# EAGLE design IV_Swinger_2_cell (EAGLE 9.2.2)
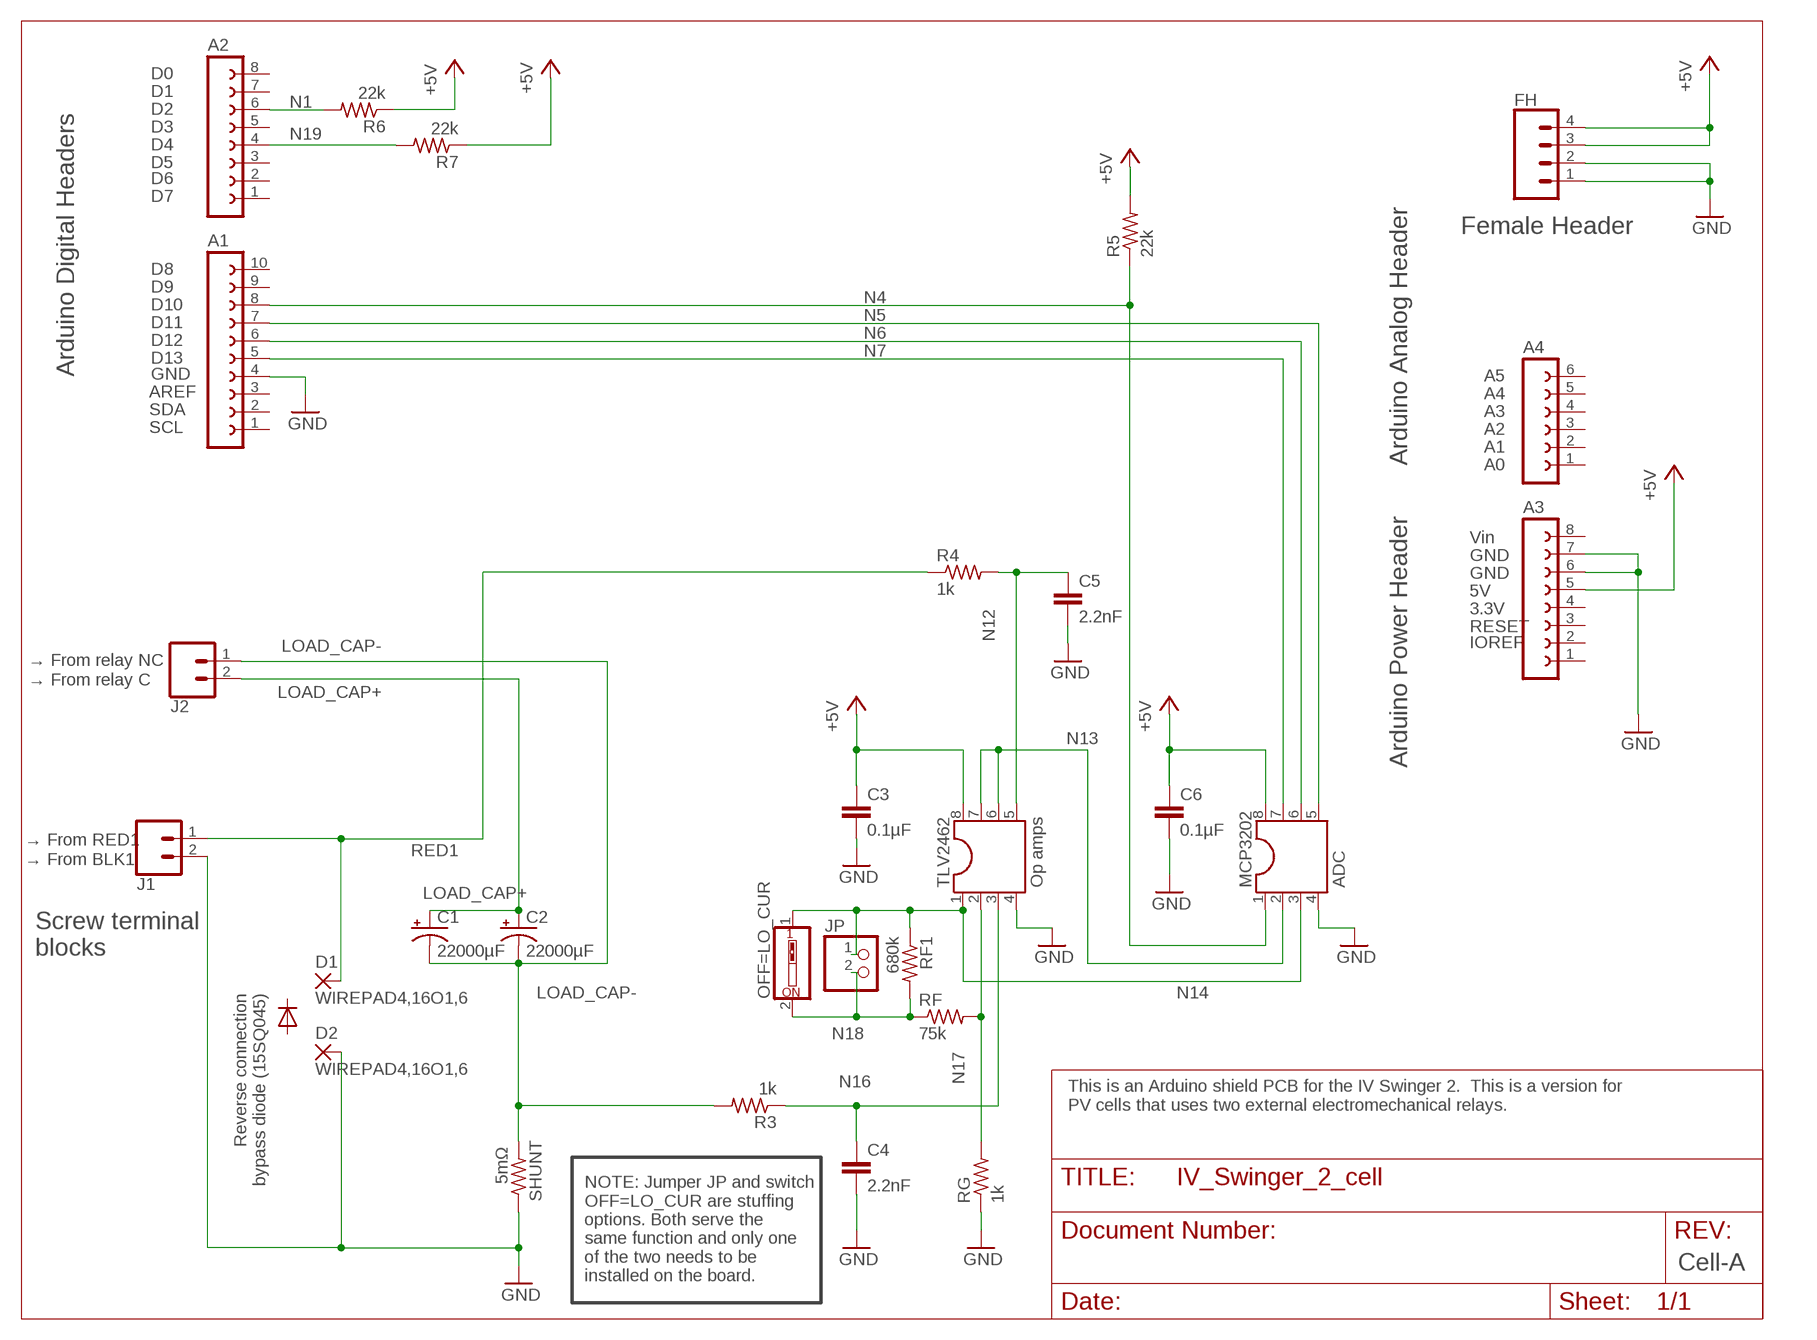
[diagram p0: schematic, sheet 1]

## Parts
A1  FE10-1  [FE10]
A2  FE08-1  [FE08]
A3  FE08-1  [FE08]
A4  FE06-1  [FE06]
C1  22000µF  CPOL-USE7.5-18  [E7,5-18]
C2  22000µF  CPOL-USE7.5-18  [E7,5-18]
C3  0.1µF  C-EU025-030X050  [C025-030X050]
C4  2.2nF  C-EU025-030X050  [C025-030X050]
C5  2.2nF  C-EU025-030X050  [C025-030X050]
C6  0.1µF  C-EU025-030X050  [C025-030X050]
D1  WIREPAD4,16O1,6  [4,16O1,6]
D2  WIREPAD4,16O1,6  [4,16O1,6]
FH  CONN_04LONGPADS  [1X04_LONGPADS]
J1  CONN_025MM  [SCREWTERMINAL-5MM-2]
J2  CONN_025MM  [SCREWTERMINAL-5MM-2]
JP  PINHD-1X2  [1X02]
MCP3202  ADC  DIL8S  [SOCKET-08]
OFF=LO_CUR  SW_DIP-1  [EDG-01]
R3  1k  R-US_0207/10  [0207/10]
R4  1k  R-US_0207/10  [0207/10]
R5  22k  R-US_0207/10  [0207/10]
R6  22k  R-US_0207/10  [0207/10]
R7  22k  R-US_0207/10  [0207/10]
RF  75k  R-US_0207/10  [0207/10]
RF1  680k  R-US_0207/10  [0207/10]
RG  1k  R-US_0207/10  [0207/10]
SHUNT  5mΩ  R-US_0617/17  [0617/17]
TLV2462  Op amps  DIL8S  [SOCKET-08]

## Nets
+5V: A3.5 C3.1 C6.1 FH.3 FH.4 MCP3202.8 R5.2 R6.1 R7.1 TLV2462.8
GND: A1.4 A3.6 A3.7 C3.2 C4.2 C5.2 C6.2 D2.1(P) FH.1 FH.2 J1.2 MCP3202.4 RG.1 SHUNT.1 TLV2462.4
LOAD_CAP+: C1.+ C2.+ J2.2
LOAD_CAP-: C1.- C2.- J2.1 R3.2 SHUNT.2
N1: A2.6 R6.2
N4: A1.8 MCP3202.1 R5.1
N5: A1.7 MCP3202.5
N6: A1.6 MCP3202.6
N7: A1.5 MCP3202.7
N12: C5.1 R4.2 TLV2462.5
N13: MCP3202.2 TLV2462.6 TLV2462.7
N14: JP.1 MCP3202.3 OFF=LO_CUR.1 RF1.1 TLV2462.1
N16: C4.1 R3.1 TLV2462.3
N17: RF.2 RG.2 TLV2462.2
N18: JP.2 OFF=LO_CUR.2 RF1.2 RF.1
N19: A2.4 R7.2
RED1: D1.1(P) J1.1 R4.1
Unconnected: A1.1 A1.2 A1.3 A1.9 A1.10 A2.1 A2.2 A2.3 A2.5 A2.7 A2.8 A3.1 A3.2 A3.3 A3.4 A3.8 A4.1 A4.2 A4.3 A4.4 A4.5 A4.6

## Notes on the sheet
- D0
- D1
- D2
- D3
- D4
- D5
- D6
- D7
- Female Header
- D8
- D9
- D10
- D11
- D12
- D13
- Arduino Digital Headers | GND
- A5
- AREF | A4
- SDA | A3
- SCL | A2
- A1
- Arduino Analog Header
- A0
- Vin
- GND
- GND
- 5V
- 3.3V
- RESET
- IOREF
- → From relay NC
- → From relay C
- Arduino Power Header
- → From RED1
- → From BLK1
- Screw terminal 
  blocks
- Reverse connection
  bypass diode (15SQ045)
- This is an Arduino shield PCB for the IV Swinger 2.  This is a version for 
  PV cells that uses two external electromechanical relays.
- Cell-A
- NOTE: Jumper JP and switch 
  OFF=LO_CUR are stuffing 
  options. Both serve the 
  same function and only one 
  of the two needs to be 
  installed on the board.

## Library data of the parts
A1 = con-lsta:FE10-1: FEMALE HEADER; OC_FARNELL: unknown; OC_NEWARK: unknown
A2 A3 = con-lsta:FE08-1: FEMALE HEADER; OC_FARNELL: unknown; OC_NEWARK: unknown
A4 = con-lsta:FE06-1: FEMALE HEADER; OC_FARNELL: unknown; OC_NEWARK: unknown
C1 C2 = rcl:CPOL-US: POLARIZED CAPACITOR, American symbol; SPICEPREFIX: C
C3-C6 = rcl:C-EU: CAPACITOR, European symbol; SPICEPREFIX: C
D1 = wirepad:WIREPAD: Wire PAD connect wire on PCB; SPICEPREFIX: X
D2 = wirepad:WIREPAD: Wire PAD connect wire on PCB
FH = my_connectors:CONN_04: Multi connection point. Often used as Generic Header-pin footprint for 0.1 inch spaced/style header connections On any of the 0.1 inch spaced packages, you can populate with these: Break Away Headers - Straight <https://www.sparkfun.com/products/116> (PRT-00116) Break Away Male Headers - Right Angle <https://www.sparkfun.com/products/553> (PRT-00553) Female Headers <https://www.sparkfun.com/products/115> (PRT-00115) Break Away Headers - Machine Pin <https://www.sparkfun.com/products/117> (PRT-00117) Break Away Female Headers - Swiss Machine Pin <https://www.sparkfun.com/products/743> (PRT-00743) For SCREWTERMINALS and SPRING TERMINALS visit here: Screw Terimnals on SparkFun.com <https://www.sparkfun.com/search/results?term=Screw+Terminals> (5mm/3.5mm/2.54mm spacing) This device is also useful as a general connection point to wire up your design to another part of your project. Our various solder wires solder well into these plated through hole pads. Hook-Up Wire - Assortment (Stranded, 22 AWG) <https://www.sparkfun.com/products/11375> (PRT-11375) Hook-Up Wire - Assortment (Solid Core, 22 AWG) <https://www.sparkfun.com/products/11367> (PRT-11367) View the entire wire category on our website here <https://www.sparkfun.com/categories/141> Special notes: Molex polarized connector foot print use with SKU : PRT-08231 with associated crimp pins and housings. 1MM SMD Version SKU: PRT-10208; PROD_ID: CONN-09696
J1 J2 = SparkFun-Connectors:CONN_02: Multi connection point. Often used as Generic Header-pin footprint for 0.1 inch spaced/style header connections On any of the 0.1 inch spaced packages, you can populate with these: Break Away Headers - Straight <https://www.sparkfun.com/products/116> (PRT-00116) Break Away Male Headers - Right Angle <https://www.sparkfun.com/products/553> (PRT-00553) Female Headers <https://www.sparkfun.com/products/115> (PRT-00115) Break Away Headers - Machine Pin <https://www.sparkfun.com/products/117> (PRT-00117) Break Away Female Headers - Swiss Machine Pin <https://www.sparkfun.com/products/743> (PRT-00743) For SCREWTERMINALS and SPRING TERMINALS visit here: Screw Terimnals on SparkFun.com <https://www.sparkfun.com/search/results?term=Screw+Terminals> (5mm/3.5mm/2.54mm spacing) This device is also useful as a general connection point to wire up your design to another part of your project. Our various solder wires solder well into these plated through hole pads. Hook-Up Wire - Assortment (Stranded, 22 AWG) <https://www.sparkfun.com/products/11375> (PRT-11375) Hook-Up Wire - Assortment (Solid Core, 22 AWG) <https://www.sparkfun.com/products/11367> (PRT-11367) View the entire wire category on our website here <https://www.sparkfun.com/categories/141> Special notes: Molex polarized connector foot print use with: PRT-08233 with associated crimp pins and housings. 2.54_SCREWTERM for use with PRT-10571. 3.5mm Screw Terminal footprints for PRT-08084 5mm Screw Terminal footprints for use with PRT-08432; SF_SKU: PRT-08432
JP = pinhead:PINHD-1X2: PIN HEADER
MCP3202 TLV2462 = ic-package:DIL8: Dual In Line / Socket
OFF=LO_CUR = special:SW_DIP-1: DIP SWITCH
R3-R7 RF RF1 RG SHUNT = rcl:R-US_: RESISTOR, American symbol; SPICEPREFIX: R

## Board
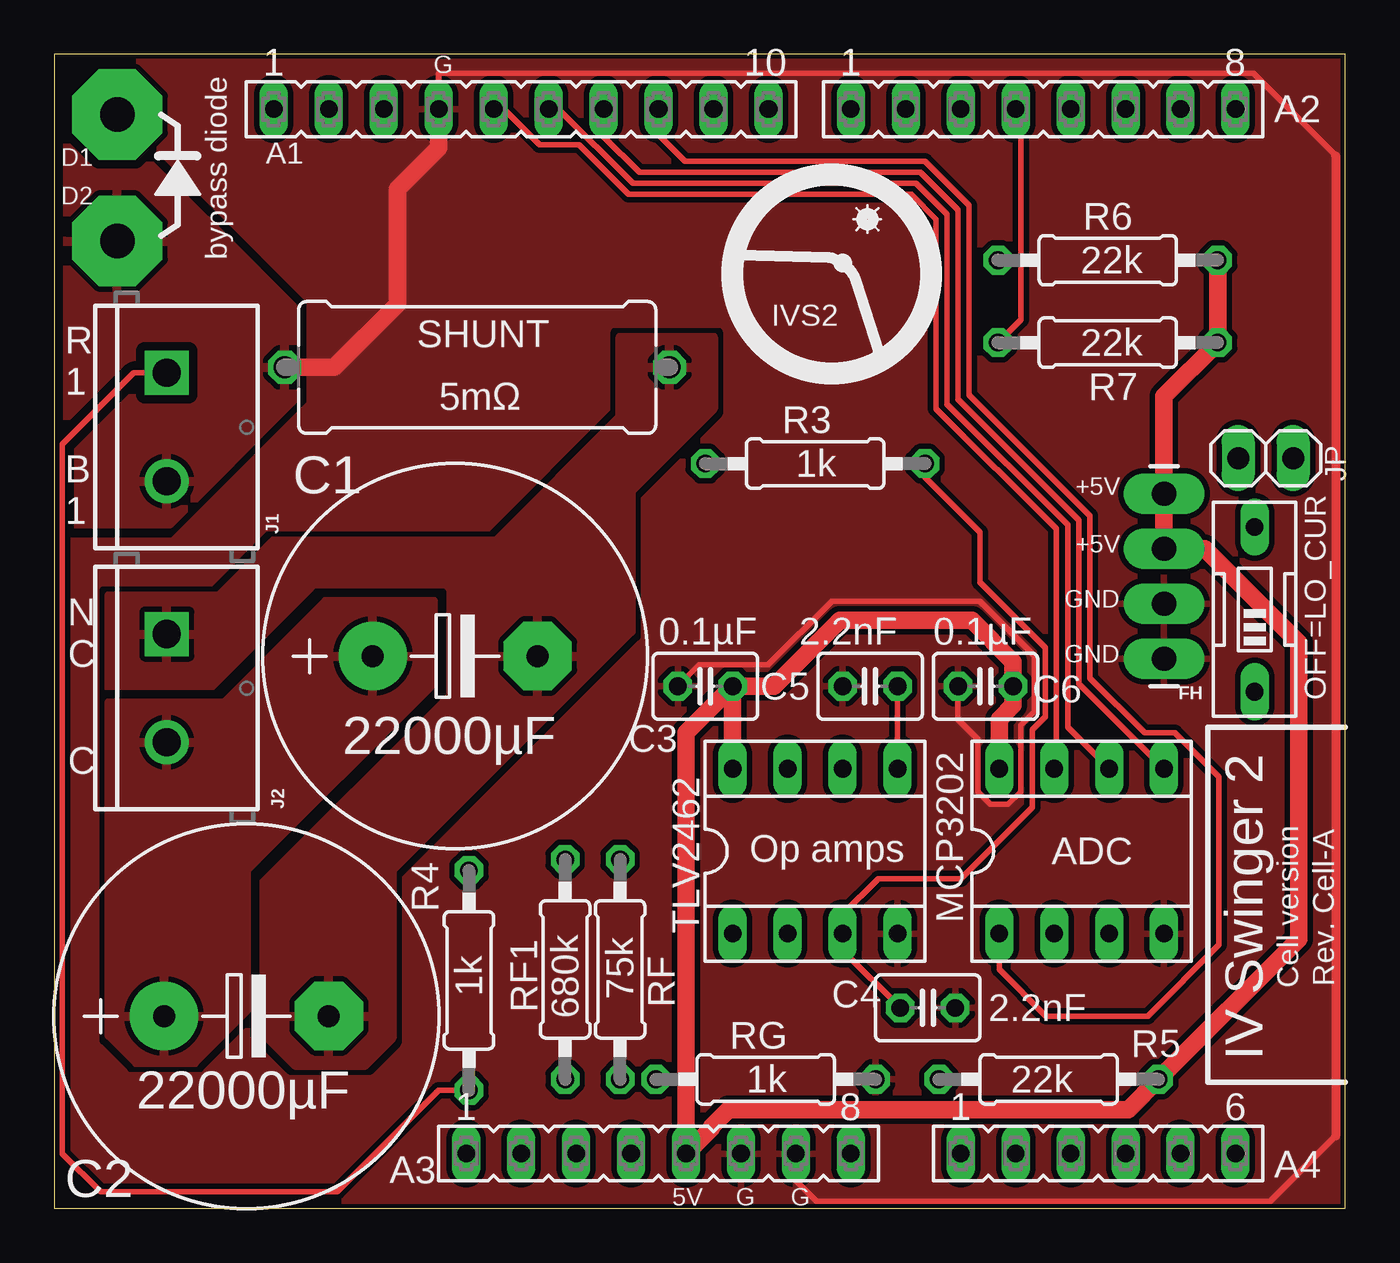
[diagram p1: board, top side]
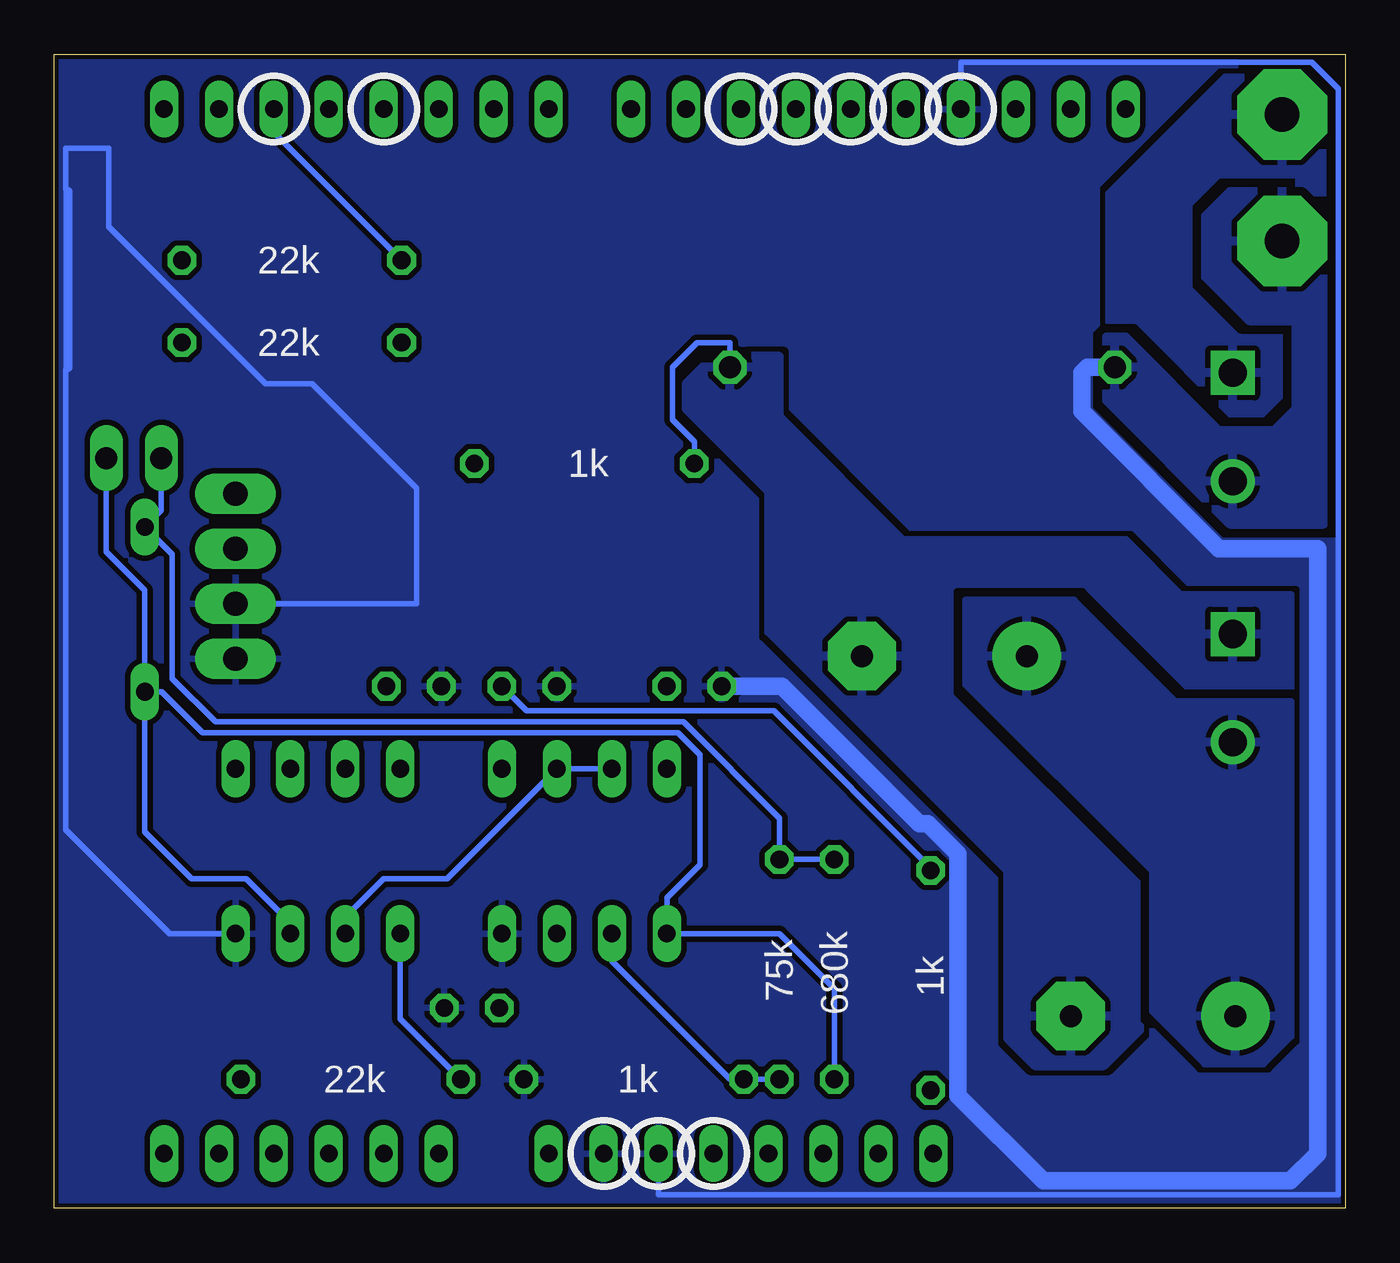
[diagram p2: board, bottom side, seen from below]

Size 59.69 x 53.34 mm. Coordinates in mm from the lower left corner, seen from the top.
Outline: 0,0 59.69,0 59.69,53.34 0,53.34 0,0
Copper layers (1*16): Top 0.035mm / dielectric 1.5mm / Bottom 0.035mm
Design rules "SparkFun-2-layer-STANDARD": minimum track width 10mil, minimum drill 20mil, track to track 10mil, track to pad 8mil, pad to pad 8mil, via to via 10mil, smd to smd 8mil, copper to edge 8mil, drill to drill 8mil, minimum pad ring 10mil, minimum via ring 10mil, stop-mask expansion 4mil, vias tented up to drill 25mil, thermal gap 10mil

### Footprints (pad centres in the part's own frame; a part is rotated, then mirrored left to right if it is on the bottom)
FE10 = drill 0.813 long: 1 -11.43,0; 2 -8.89,0; 3 -6.35,0; 4 -3.81,0; 5 -1.27,0; 6 1.27,0; 7 3.81,0; 8 6.35,0; 9 8.89,0; 10 11.43,0
FE08 = drill 0.813 long: 1 -8.89,0; 2 -6.35,0; 3 -3.81,0; 4 -1.27,0; 5 1.27,0; 6 3.81,0; 7 6.35,0; 8 8.89,0
FE06 = drill 0.813 long: 1 -6.35,0; 2 -3.81,0; 3 -1.27,0; 4 1.27,0; 5 3.81,0; 6 6.35,0
E7,5-18 = drill 1.016 pad 3.15: + -3.81,0 | drill 1.016 pad 3.15 octagon: - 3.81,0
C025-030X050 = drill 0.813 octagon: 1 -1.27,0; 2 1.27,0
4,16O1,6 = drill 1.6 pad 4.166 octagon: 1 0,0
1X04_LONGPADS = drill 1.118 pad 1.88 long: 1 0,0; 2 2.54,0; 3 5.08,0; 4 7.62,0
SCREWTERMINAL-5MM-2 = drill 1.3 pad 2.032 square: 1 0,0 | drill 1.3 pad 2.032: 2 5,0
1X02 = drill 1.016 long: 1 -1.27,0; 2 1.27,0
SOCKET-08 = drill 0.813 long: 1 -3.81,-3.81; 2 -1.27,-3.81; 3 1.27,-3.81; 4 3.81,-3.81; 5 3.81,3.81; 6 1.27,3.81; 7 -1.27,3.81; 8 -3.81,3.81
EDG-01 = drill 0.813 long: 1 0,-3.81; 2 0,3.81
0207/10 = drill 0.813 octagon: 1 -5.08,0; 2 5.08,0
0617/17 = drill 1.016 octagon: 1 -8.89,0; 2 8.89,0

### Placement (x,y rotation side)
A1  21.59,50.8 0 top
A2  45.72,50.8 0 top
A3  27.94,2.54 0 top
A4  48.26,2.54 0 top
C1  18.54,25.53 0 top
C2  8.89,8.89 0 top
C3  30.1,24.13 180 top
C4  40.39,9.27 0 top
C5  37.72,24.13 180 top
C6  43.05,24.13 180 top
D1  2.92,50.55 0 top
D2  2.92,44.7 0 top
FH  51.31,25.4 90 top
J1  5.21,38.61 270 top
J2  5.21,26.54 270 top
JP  56.01,34.67 180 top
MCP3202  47.5,16.51 0 top
OFF=LO_CUR  55.5,27.69 0 top
R3  35.18,34.42 180 top
R4  19.18,10.54 90 top
R5  45.97,5.97 0 top
R6  48.7,43.81 180 top
R7  48.7,40.01 180 top
RF  26.16,11.05 270 top
RF1  23.62,11.05 90 top
RG  32.89,5.97 180 top
SHUNT  19.56,38.86 0 top
TLV2462  35.18,16.51 0 top

### Tracks (layer width: path | path; a pad name or v marks a point on that pad's centre or on a via)
+5V
  Top 0.813: C3.1 29.21,21.97 A3.5 30.38,3.71 30.38,3.77 31.18,4.57 49.66,4.57 R5.2 57.53,12.45 57.53,26.14 53.19,30.48 FH.3 FH.4 51.31,37.53 R7.1 R6.1 | C3.1 TLV2462.8 | MCP3202.8 43.69,22.61 44.32,23.24 C6.1 44.32,25.27 42.42,27.18 36.32,27.18 33.27,24.13 C3.1
GND
  Top 0.254: A1.4 17.78,52.45 55.42,52.45 59.23,48.64 | 59.23,3.35 56.21,0.33 35.23,0.33 34.29,1.27 A3.7 | C3.2 29.82,25.12 33.01,25.12 35.95,28.07 42.79,28.07 45.31,25.54 45.31,22.97 44.68,22.34 44.68,19.25 44.1,18.67 43.28,18.67 42.7,19.25 42.7,21.69 41.78,22.61 C6.2
  Top 0.406: 59.23,48.64 59.23,3.35
  Top 0.813: A1.4 17.78,49.02 15.88,47.12 15.88,41.78 12.95,38.86 SHUNT.1
  Bottom 0.254: FH.2 42.93,27.94 42.93,33.27 47.75,38.1 49.91,38.1 57.17,45.36 57.17,49 59.16,49 59.16,47.09 59.05,46.99 | 59.05,38.87 59.16,38.76 59.16,17.5 54.36,12.7 MCP3202.4 | A3.6 31.75,0.64 0.33,0.64 0.33,51.74 1.55,52.96 17.78,52.96 A1.4
  Bottom 0.406: 59.05,46.99 59.05,38.87
  Bottom 0.813: SHUNT.1 11.94,38.86 12.19,38.61 12.19,36.83 5.84,30.48 1.27,30.48 1.27,2.54 2.54,1.27 13.97,1.27 17.91,5.21 17.91,16.38 19.3,17.78 19.68,17.78 26.04,24.13 C3.2
  pour Bottom (rank 6): 0,30.86 5.71,30.86 11.81,36.96 11.81,40.51 5.08,47.24 5.08,53.34 59.69,53.34 59.69,0 0,0
  pour Top (isolate 0.406): 0,49.78 2.92,49.78 11.05,41.66 11.05,37.34 5.33,31.62 0,31.62
  pour Top (rank 6): 0,30.86 5.46,30.86 11.81,37.21 11.81,41.91 3.81,49.91 3.81,53.34 59.69,53.34 59.69,0 0,0
  pour Bottom (isolate 0.406): 1.02,46.99 5.33,46.99 6.48,45.85 6.48,43.05 4.45,41.02 2.29,41.02 2.29,36.96 3.3,35.94 5.84,35.94 10.16,40.26 11.05,40.26 11.05,37.34 5.33,31.62 1.02,31.62
LOAD_CAP+
  pour Bottom (isolate 0.406): 12.57,28.07 17.53,28.07 17.53,24.26 8.89,15.62 8.89,9.14 6.48,6.73 3.81,6.73 2.54,8 2.54,23.37 7.87,23.37
  pour Top (isolate 0.406): 12.57,28.07 17.53,28.07 17.53,24.26 8.89,15.62 8.89,9.14 6.48,6.73 3.81,6.73 2.54,8 2.54,23.37 7.87,23.37
LOAD_CAP-
  Bottom 0.254: R3.2 30.1,35.43 31.11,36.45 31.11,38.86 29.97,40.01 28.45,40.01 SHUNT.2
  pour Bottom (isolate 0.406, rank 2): 2.54,23.37 2.54,28.32 7.62,28.32 10.16,30.86 20.45,30.86 26.16,36.58 26.16,39.37 29.21,39.37 30.48,38.1 30.48,36.96 26.67,33.15 26.67,26.67 15.62,15.62 15.62,7.87 14.35,6.6 11.18,6.6 8.89,8.89 8.89,15.62 17.53,24.26 17.53,28.07 12.57,28.07 7.87,23.37
  pour Top (isolate 0.406, rank 2): 2.54,23.37 2.54,28.32 7.62,28.32 10.16,30.86 20.45,30.86 26.16,36.58 26.16,40.26 30.48,40.26 30.48,36.96 26.67,33.15 26.67,26.67 15.62,15.62 15.62,7.87 14.35,6.6 11.18,6.6 8.89,8.89 8.89,15.62 17.53,24.26 17.53,28.07 12.57,28.07 7.87,23.37
N1
  Bottom 0.254: A2.6 49.53,49.72 R6.2
N4
  Top 0.254: A1.8 27.94,49.61 29.17,48.39 40.26,48.39 42.29,46.35 42.29,37.59 47.88,32 47.88,24.51 50.42,21.97 51.82,21.97 53.85,19.94 53.85,12.19 50.55,8.89 45.85,8.89 43.69,11.05 MCP3202.1
  Bottom 0.254: R5.1 43.69,8.76 MCP3202.1
N5
  Top 0.254: A1.7 25.4,49.53 27.05,47.88 40.05,47.88 41.78,46.14 41.78,37.38 47.37,31.79 47.37,24.26 MCP3202.5
N6
  Top 0.254: A1.6 23.32,50.8 26.75,47.37 39.83,47.37 41.27,45.93 41.27,37.17 46.86,31.58 46.86,22.23 MCP3202.6
N7
  Top 0.254: MCP3202.7 46.33,20.42 46.33,31.4 40.77,36.96 40.77,45.72 39.62,46.86 26.54,46.86 24.26,49.15 22.45,49.15 20.8,50.8 A1.5
N12
  Top 0.254: TLV2462.5 C5.1
  Bottom 0.254: C5.1 37.85,22.99 26.41,22.99 19.18,15.75 R4.2
N13
  Bottom 0.254: TLV2462.7 TLV2462.6 41.53,15.24 44.45,15.24 46.23,13.46 MCP3202.2
N14
  Bottom 0.254: RF1.1 23.62,10.16 26.16,12.7 TLV2462.1 31.37,14.35 29.84,15.88 29.84,20.95 30.86,21.97 52.82,21.97 54.72,23.88 OFF=LO_CUR.1 | JP.1 57.28,30.35 55.5,28.57 OFF=LO_CUR.1 | OFF=LO_CUR.1 55.5,17.4 53.34,15.24 50.8,15.24 48.77,13.21 MCP3202.3
N16
  Top 0.254: R3.1 40.26,33.79 42.8,31.24 42.8,28.94 45.82,25.92 45.82,22.72 45.21,22.11 45.21,18.54 41.91,15.24 38.1,15.24 36.45,13.59 TLV2462.3 36.45,11.94 C4.1
N17
  Bottom 0.254: RF.2 RG.2 28.45,5.97 33.91,11.43 TLV2462.2
N18
  Bottom 0.254: RF1.2 RF.1 26.16,18.03 30.61,22.48 52.23,22.48 54.23,24.48 54.23,30.23 OFF=LO_CUR.2 54.74,32.26 JP.2
N19
  Top 0.254: A2.4 44.68,50.57 44.68,41.06 R7.2
RED1
  Top 0.254: J1.1 3.68,38.61 0.38,35.31 0.38,2.54 2.16,0.76 13.08,0.76 17.78,5.46 R4.1
  pour Bottom (isolate 0.406, rank 2): 0,53.34 4.45,53.34 10.92,46.86 10.92,41.02 5.84,35.94 3.17,35.94 2.16,36.96 2.16,41.02 2.29,41.15 4.45,41.15 6.48,43.18 6.48,45.85 5.33,46.99 0,46.99

### Text on the board
tPlace: bypass diode | G | IVS2 | R / 1 | +5V | B / 1 | +5V | GND | GND | N / C | C | Cell version | Rev. Cell-A | IV Swinger 2 | 5V | G | G
bPlace: 22k | 22k | 1k | 680k | 1k | 75k | 1k | 22k